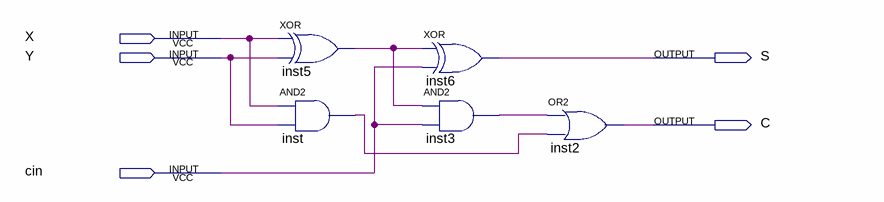
[diagram p0: schematic sheet]
// Quartus schematic adder.bdf as structural Verilog: 5 symbols, 5 pins
module adder (
  input  X,
  input  Y,
  input  cin,
  output S,
  output C
);

  wire inst3_out, inst5_out, inst_out;

  xor inst5 (inst5_out, X, Y);
  and inst (inst_out, X, Y);
  xor inst6 (S, inst5_out, cin);
  and inst3 (inst3_out, inst5_out, cin);
  or inst2 (C, inst3_out, inst_out);
endmodule
